# Altium project Node.PrjPCB
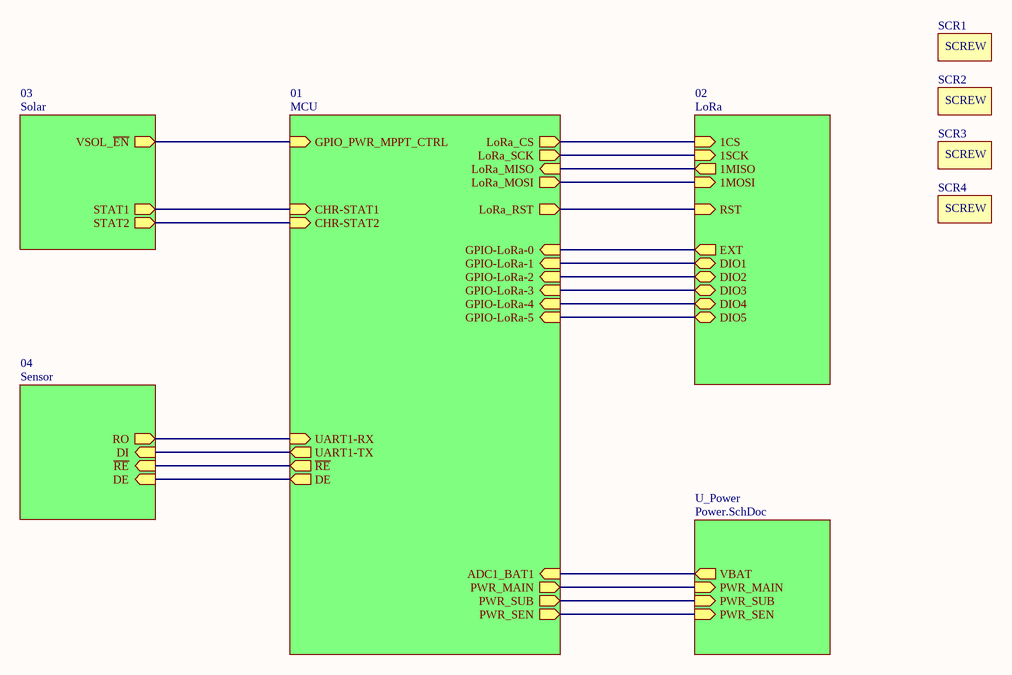
[diagram p0: Main.SchDoc]
6 sheets, 140 parts. Net scope: hierarchical (ports join the sheet entries above them; power ports are global).
Board file: Node_v2.PcbDoc
Sheets:
  Main.SchDoc
    03 = Solar.SchDoc
    01 = MCU.SchDoc
    02 = LoRa.SchDoc
    04 = Sensor.SchDoc
    U_Power = Power.SchDoc

## Sheet Main.SchDoc: =ProjectName
size A4; CheckedBy: DatNB; Author: Ven; CompanyName: Nacentech; Organization: IMET

### Parts
SCR1  Screw 3mm  [SCREW]  (value not drawn)
SCR2  Screw 3mm  [SCREW]  (value not drawn)
SCR3  Screw 3mm  [SCREW]  (value not drawn)
SCR4  Screw 3mm  [SCREW]  (value not drawn)

### Sub-sheets
01 = MCU: LoRa_MOSI (out), LoRa_MISO (in), CHR-STAT2 (in), CHR-STAT1 (in), UART1-TX (out), ADC1_BAT1 (in), LoRa_RST (out), LoRa_CS (out), UART1-RX (in), LoRa_SCK (out), GPIO_PWR_MPPT_CTRL (in), GPIO-LoRa-4 (in), GPIO-LoRa-1 (in), GPIO-LoRa-0 (in), GPIO-LoRa-3 (in), GPIO-LoRa-5 (in), GPIO-LoRa-2 (in), PWR_SEN (out), PWR_MAIN (out), PWR_SUB (out), DE (out), ~{RE} (out)
02 = LoRa: 1CS (in), 1MOSI (in), EXT (out), 1MISO (out), 1SCK (in), RST (in), DIO4 (bidir), DIO5 (bidir), DIO1 (bidir), DIO3 (bidir), DIO2 (bidir)
03 = Solar: STAT1 (out), STAT2 (out), VSOL_~{EN} (out)
04 = Sensor: RO (out), DI (in), ~{RE} (in), DE (in)
U_Power = Power.SchDoc: VBAT (out), PWR_SUB (in), PWR_MAIN (in), PWR_SEN (in)

### Nets
NetR14_2: sheet 01/UART1-RX, sheet 04/RO
NetR15_2: sheet 01/~{RE}, sheet 04/~{RE}
NetR17_2: sheet 01/DE, sheet 04/DE
NetR18_2: sheet 01/UART1-TX, sheet 04/DI
NetR24_1: sheet 01/ADC1_BAT1, sheet U_Power/VBAT
NetR34_2: sheet 01/PWR_SEN, sheet U_Power/PWR_SEN
NetR35_2: sheet 01/PWR_SUB, sheet U_Power/PWR_SUB
NetR36_2: sheet 01/PWR_MAIN, sheet U_Power/PWR_MAIN
NetR48_1: sheet 03/STAT1, sheet 01/CHR-STAT1
NetR49_1: sheet 03/STAT2, sheet 01/CHR-STAT2
NetR52_2: sheet 03/VSOL_~{EN}, sheet 01/GPIO_PWR_MPPT_CTRL
NetU1_4: sheet 01/LoRa_RST, sheet 02/RST
NetU1_5: sheet 01/GPIO-LoRa-0, sheet 02/EXT
NetU1_6: sheet 01/GPIO-LoRa-1, sheet 02/DIO1
NetU1_7: sheet 01/GPIO-LoRa-2, sheet 02/DIO2
NetU1_8: sheet 01/GPIO-LoRa-3, sheet 02/DIO3
NetU1_10: sheet 01/GPIO-LoRa-4, sheet 02/DIO4
NetU1_11: sheet 01/GPIO-LoRa-5, sheet 02/DIO5
NetU1_12: sheet 01/LoRa_SCK, sheet 02/1SCK
NetU1_13: sheet 01/LoRa_MISO, sheet 02/1MISO
NetU1_14: sheet 01/LoRa_MOSI, sheet 02/1MOSI
NetU1_15: sheet 01/LoRa_CS, sheet 02/1CS

Not connected (* = marked no-connect by the designer): SCR1 0; SCR2 0; SCR3 0; SCR4 0

### Notes on the sheet
- Project:
- Page Contents:
- Size:
- Date:
- A4
- Checked by:
- Time:
- Revision:
- Sheet
- of
- File:
- (in symbol screw3m) SCREW

### Library data of the parts
SCR1-SCR4 = screw3m

## Sheet Solar.SchDoc: =ProjectName
size A4; CheckedBy: DatNB; Author: Ven; CompanyName: Nacentech; Organization: IMET
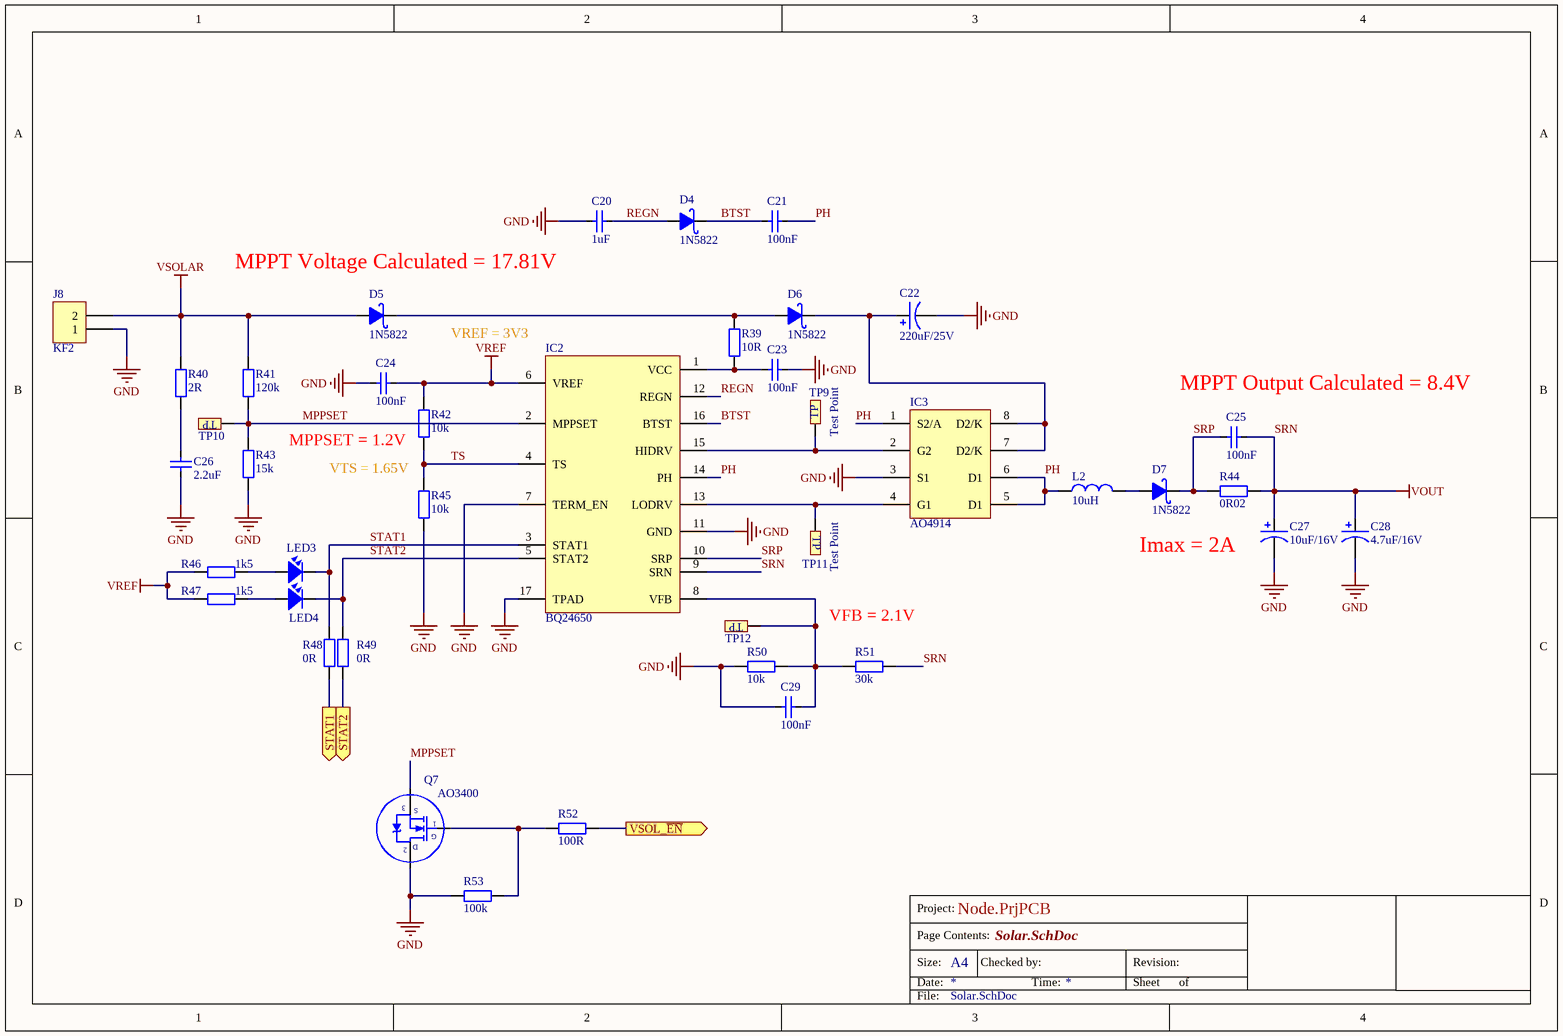
[diagram p1: Solar.SchDoc]

### Parts
C20  1uF  [CAP_0805]
C21  100nF  [CAP_0805]
C22  220uF/25V  [C5mm]
C23  100nF  [CAP_0805]
C24  100nF  [CAP_0805]
C25  100nF  [CAP_0805]
C26  2.2uF  [CAP_0805]
C27  10uF/16V  [C5mm]
C28  4.7uF/16V  [C5mm]
C29  100nF  [CAP_0805]
D4  1N5822  [DIO-214AC(SMA)]
D5  1N5822  [DIO-214AC(SMA)]
D6  1N5822  [DIO-214AC(SMA)]
D7  1N5822  [DIO-214AC(SMA)]
IC2  BQ24650  [VQFN-16]
IC3  AO4914  [SOIC-8]
J8  KF2  [KF2-5.08]
L2  10uH  [L-SMD-M-7.3x4.5]
LED3  LED  [LED-0805-Red]  (value not drawn)
LED4  LED  [LED-0805-Orange]  (value not drawn)
Q7  AO3400  [SOT23A]
R39  10R  [RES-SMD-0805]
R40  2R  [RES-SMD-0805]
R41  120k  [RES-SMD-0805]
R42  10k  [RES-SMD-0805]
R43  15k  [RES-SMD-0805]
R44  0R02  [RES-SMD-2512]
R45  10k  [RES-SMD-0805]
R46  1k5  [RES-SMD-0805]
R47  1k5  [RES-SMD-0805]
R48  0R  [RES-SMD-0805]
R49  0R  [RES-SMD-0805]
R50  10k  [RES-SMD-0805]
R51  30k  [RES-SMD-0805]
R52  100R  [RES-SMD-0805]
R53  100k  [RES-SMD-0805]
TP9  Test Point  [TP_SMD]
TP10  Test Point  [TP_SMD]  (value not drawn)
TP11  Test Point  [TP_SMD]
TP12  Test Point  [TP_SMD]  (value not drawn)

### Ports
STAT1 (out), STAT2 (out), VSOL_~{EN} (out)

### Nets
GND: C20.2 C22.2 C23.2 C24.2 C26.1 C27.2 C28.2 C29.1 IC2.7(TERM_EN) IC2.11(GND) IC2.17(TPAD) IC3.3(S1) J8.1 Q7.2(D) R43.2 R45.1 R50.1 R53.2
SRN: C25.1 C27.1 C28.1 IC2.9(SRN) R44.2 R51.1  [also labelled VOUT]
VREF: C24.1 IC2.6(VREF) R42.1 R46.1 R47.1
VSOLAR: D5.1(A) J8.2 R40.1 R41.2
BTST: C21.1 D4.2(K) IC2.16(BTST)
MPPSET: IC2.2(MPPSET) Q7.3(S) R41.1 R43.1 TP10.1
PH: C21.2 IC2.14(PH) IC3.1(S2/A) IC3.5(D1) IC3.6(D1) L2.1
REGN: C20.1 D4.1(A) IC2.12(REGN)
SRP: C25.2 D7.2(K) IC2.10(SRP) R44.1
STAT1: IC2.3(STAT1) LED3.2 R48.2
STAT2: IC2.5(STAT2) LED4.2 R49.2
TS: IC2.4(TS) R42.2 R45.2
NetC22_1: C22.1 D6.2(K) IC3.7(D2/K) IC3.8(D2/K)
NetC23_1: C23.1 IC2.1(VCC) R39.2
NetC26_2: C26.2 R40.2
NetC29_2: C29.2 IC2.8(VFB) R50.2 R51.2 TP12.1
NetD5_2: D5.2(K) D6.1(A) R39.1
NetD7_1: D7.1(A) L2.2
NetIC2_13: IC2.13(LODRV) IC3.4(G1) TP11.1
NetIC2_15: IC2.15(HIDRV) IC3.2(G2) TP9.1
NetLED3_1: LED3.1 R46.2
NetLED4_1: LED4.1 R47.2
NetQ7_1: Q7.1(G) R52.1 R53.1
NetR48_1: R48.1 ; port STAT1
NetR49_1: R49.1 ; port STAT2
NetR52_2: R52.2 ; port VSOL_~{EN}

### Notes on the sheet
- MPPT Voltage Calculated = 17.81V
- (near IC2) VREF = 3V3
- MPPSET = 1.2V
- (near C25) MPPT Output Calculated = 8.4V
- VTS = 1.65V
- Imax = 2A
- (near R51) VFB = 2.1V
- Project:
- Page Contents:
- Size:
- Date:
- A4
- Checked by:
- Time:
- Revision:
- Sheet
- of
- File:

### Library data of the parts
C20 C21 C23-C26 C29 = CapSMD: Capacitor; Value: 33p; Published: 8-Jun-2000; LatestRevisionDate: 17-Jul-2002; LatestRevisionNote: Re-released for DXP Platform.; PackageReference: RAD-0.3; Publisher: Altium Limited
C22 C27 C28 = Cap Pol: Polarized Capacitor (Axial); Published: 8-Jun-2000; LatestRevisionDate: 17-Jul-2002; LatestRevisionNote: Re-released for DXP Platform.; PackageReference: POLAR0.8; Publisher: Altium Limited
D4-D7 = 1N5822: Schottky Rectifiers; Value: Diode c?m 1N5408
IC2 = BQ24650: BQ24650 Stand-Alone Synchronous Buck Battery Charge Controller for Solar Power / With Maximum Power Point Tracking
IC3 = AO4914: Dual N-Channel Enhancement Mode Field Effect Transistor with Schottky Diode
J8 = KF2: Manufacturer: Würth Elektronik eiSos GmbH; partNo: 691103110002; ComponentLink1 Description: Manufacturer; ComponentLink2 Description: Datasheet; NoPins: 2; Created Date: 29 October 2013; ComponentLink1URL: http://www.we-online.com; ComponentLink2URL: http://katalog.we-online.de/em/datasheet/6911031100xx.pdf; Created by: Karrer Zheng
L2 = Inductor: Value: 150 mH
LED3 LED4 = LED: LED Single colour Green and Red; Value: LED 3 ly Single Colour
Q7 = MOSFET_N: Generic N Channel MOSFET
R39-R53 = Resistor - SMD: Resistor SMD; Manufacturer: Generic Components; Class: Passive; Published: 08/06/2000; Publisher: Altium Hobart Technology Centre
TP9-TP12 = TP: CONNECT 1

## Sheet MCU.SchDoc: =ProjectName
size A4; CheckedBy: DatNB; Author: Ven; CompanyName: Nacentech; Organization: IMET
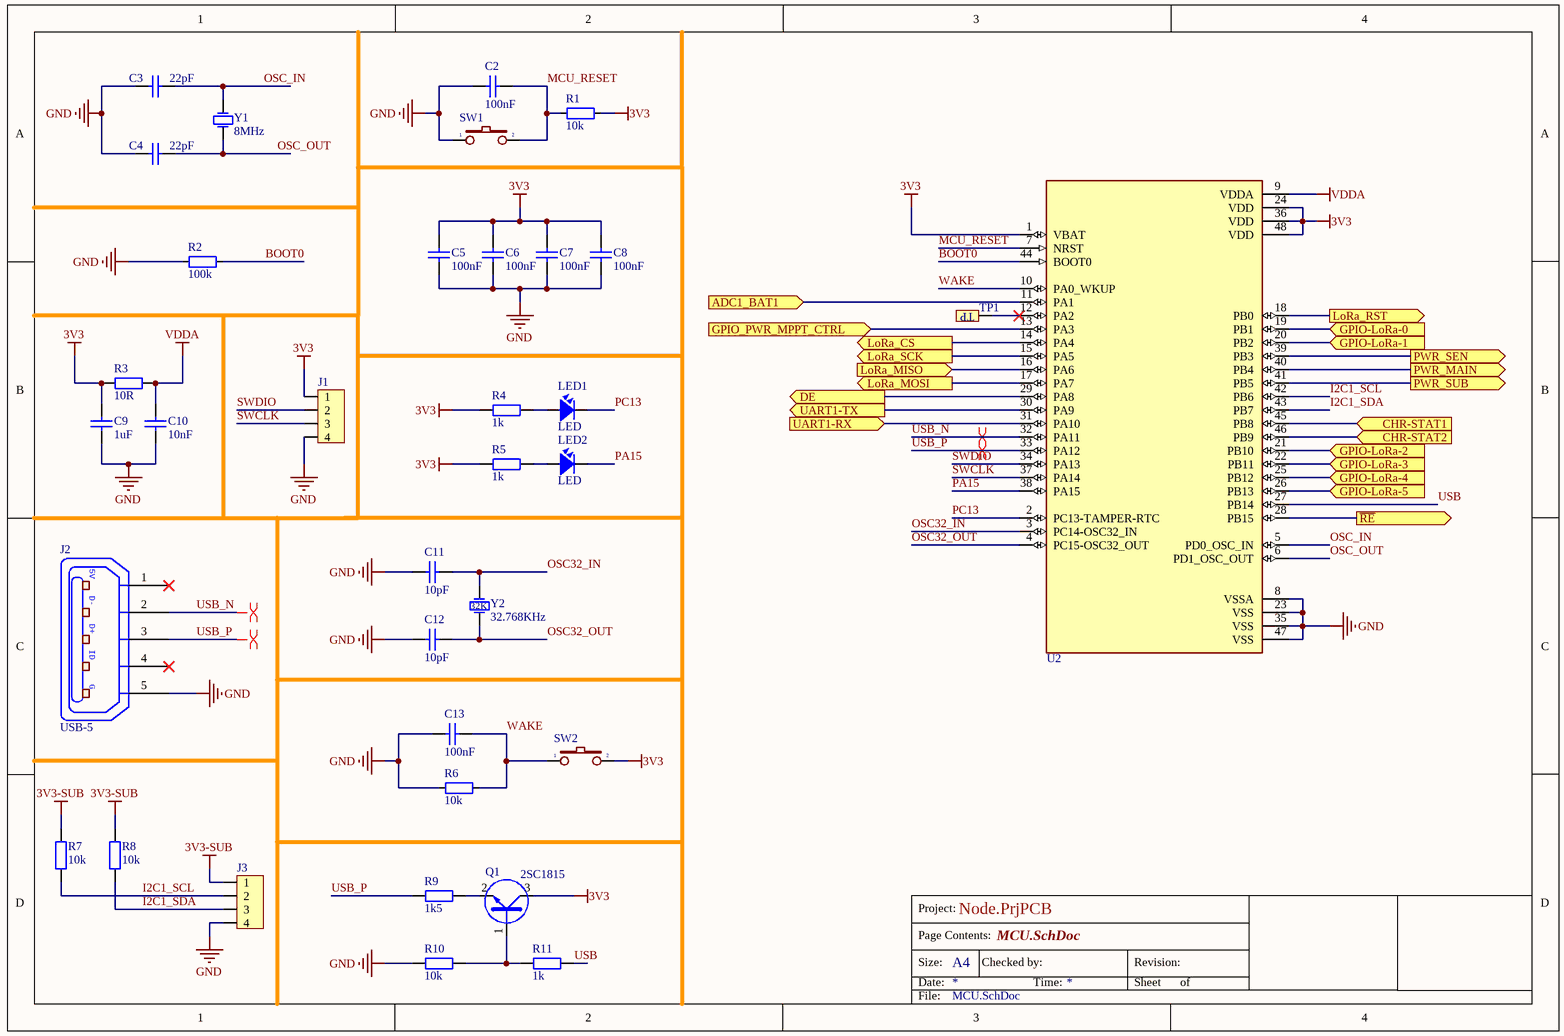
[diagram p2: MCU.SchDoc]

### Parts
C2  100nF  [CAP_0805]
C3  22pF  [CAP_0805]
C4  22pF  [CAP_0805]
C5  100nF  [CAP_0805]
C6  100nF  [CAP_0805]
C7  100nF  [CAP_0805]
C8  100nF  [CAP_0805]
C9  1uF  [CAP_0805]
C10  10nF  [CAP_0805]
C11  10pF  [CAP_0805]
C12  10pF  [CAP_0805]
C13  100nF  [CAP_0805]
J1  ST_Link  [HEADER4P-1.25]  (value not drawn)
J2  USB-5  [USB-M4]
J3  ST_Link  [HEADER4P-1.25]  (value not drawn)
LED1  LED  [LED-0805-Red]
LED2  LED  [LED-0805-Yellow]
Q1  2SC1815  [SOT23D]
R1  10k  [RES-SMD-0805]
R2  100k  [RES-SMD-0805]
R3  10R  [RES-SMD-0805]
R4  1k  [RES-SMD-0805]
R5  1k  [RES-SMD-0805]
R6  10k  [RES-SMD-0805]
R7  10k  [RES-SMD-0805]
R8  10k  [RES-SMD-0805]
R9  1k5  [RES-SMD-0805]
R10  10k  [RES-SMD-0805]
R11  1k  [RES-SMD-0805]
SW1  SW  [SW 3x2x4]  (value not drawn)
SW2  SW  [SW 3x2x4]  (value not drawn)
TP1  Test Point  [TP_SMD]  (value not drawn)
U2  STM32  [LQFP 48]  (value not drawn)
Y1  8MHz  [XTAL]
Y2  32.768KHz  [XTAL32K]

### Ports
ADC1_BAT1 (in), CHR-STAT1 (in), CHR-STAT2 (in), DE (out), GPIO-LoRa-0 (in), GPIO-LoRa-1 (in), GPIO-LoRa-2 (in), GPIO-LoRa-3 (in), GPIO-LoRa-4 (in), GPIO-LoRa-5 (in), GPIO_PWR_MPPT_CTRL (in), LoRa_CS (out), LoRa_MISO (in), LoRa_MOSI (out), LoRa_RST (out), LoRa_SCK (out), PWR_MAIN (out), PWR_SEN (out), PWR_SUB (out), UART1-RX (in), UART1-TX (out), ~{RE} (out)

### Nets
3V3: C5.2 C6.2 C7.2 C8.2 C9.2 J1.1 Q1.3(C) R1.1 R3.1 R4.1 R5.1 SW2.2 U2.1(VBAT) U2.24(VDD) U2.36(VDD) U2.48(VDD)
3V3-SUB: J3.1 R7.2 R8.2
GND: C2.1 C3.1 C4.1 C5.1 C6.1 C7.1 C8.1 C9.1 C10.1 C11.2 C12.2 C13.1 J1.4 J2.5(P5) J3.4 R2.2 R6.2 R10.1 SW1.1 U2.8(VSSA) U2.23(VSS) U2.35(VSS) U2.47(VSS)
VDDA: C10.2 R3.2 U2.9(VDDA)
BOOT0: R2.1 U2.44(BOOT0)
I2C1_SCL: J3.2 R7.1 U2.42(PB6)
I2C1_SDA: J3.3 R8.1 U2.43(PB7)
MCU_RESET: C2.2 R1.2 SW1.2 U2.7(NRST)
OSC32_IN: C11.1 U2.3(PC14-OSC32_IN) Y2.1(OSC1)
OSC32_OUT: C12.1 U2.4(PC15-OSC32_OUT) Y2.2(OSC2)
OSC_IN: C3.2 U2.5(PD0_OSC_IN) Y1.1(OSC1)
OSC_OUT: C4.2 U2.6(PD1_OSC_OUT) Y1.2(OSC2)
PA15: LED2.2 U2.38(PA15)
PC13: LED1.2 U2.2(PC13-TAMPER-RTC)
SWCLK: J1.3 U2.37(PA14)
SWDIO: J1.2 U2.34(PA13)
USB: R11.2 U2.27(PB14)
USB_N: J2.2(P2) U2.32(PA11)
USB_P: J2.3(P3) R9.1 U2.33(PA12)
WAKE: C13.2 R6.1 SW2.1 U2.10(PA0_WKUP)
NetLED1_1: LED1.1 R4.2
NetLED2_1: LED2.1 R5.2
NetQ1_1: Q1.1(B) R10.2 R11.1
NetQ1_2: Q1.2(E) R9.2
NetR14_2: U2.31(PA10) ; port UART1-RX
NetR15_2: U2.28(PB15) ; port ~{RE}
NetR17_2: U2.29(PA8) ; port DE
NetR18_2: U2.30(PA9) ; port UART1-TX
NetR24_1: U2.11(PA1) ; port ADC1_BAT1
NetR34_2: U2.39(PB3) ; port PWR_SEN
NetR35_2: U2.41(PB5) ; port PWR_SUB
NetR36_2: U2.40(PB4) ; port PWR_MAIN
NetR48_1: U2.45(PB8) ; port CHR-STAT1
NetR49_1: U2.46(PB9) ; port CHR-STAT2
NetR52_2: U2.13(PA3) ; port GPIO_PWR_MPPT_CTRL
NetTP1_1: TP1.1 U2.12(PA2)
NetU1_4: U2.18(PB0) ; port LoRa_RST
NetU1_5: U2.19(PB1) ; port GPIO-LoRa-0
NetU1_6: U2.20(PB2) ; port GPIO-LoRa-1
NetU1_7: U2.21(PB10) ; port GPIO-LoRa-2
NetU1_8: U2.22(PB11) ; port GPIO-LoRa-3
NetU1_10: U2.25(PB12) ; port GPIO-LoRa-4
NetU1_11: U2.26(PB13) ; port GPIO-LoRa-5
NetU1_12: U2.15(PA5) ; port LoRa_SCK
NetU1_13: U2.16(PA6) ; port LoRa_MISO
NetU1_14: U2.17(PA7) ; port LoRa_MOSI
NetU1_15: U2.14(PA4) ; port LoRa_CS

Not connected (* = marked no-connect by the designer): J2 1(P1)* 4(P4)*

### Layout directives
differential pair: USB_N, USB_P

### Notes on the sheet
- Project:
- Page Contents:
- Size:
- Date:
- A4
- Checked by:
- Time:
- Revision:
- Sheet
- of
- File:
- (in symbol USB-5) 5V; D-; D+; ID; G
- (in symbol XTAL/32KHz) 32K

### Library data of the parts
C2-C13 = CapSMD: Capacitor; Value: 33p; Published: 8-Jun-2000; LatestRevisionDate: 17-Jul-2002; LatestRevisionNote: Re-released for DXP Platform.; PackageReference: RAD-0.3; Publisher: Altium Limited
J1 J3 = Header4: Header IDC, 4 x 1 Pin Vertical 2.54mm Pitch (Non-Boxed, Male); Manufacturer: W¨¹rth Elektronik eiSos GmbH; partNo: 613002143121; ComponentLink1 Description: Manufacturer; ComponentLink2 Description: Datasheet; NoPins: 02; Created Date: 29 March 2013; ComponentLink1URL: http://www.we-online.com; ComponentLink2URL: http://katalog.we-online.de/em/datasheet/6130xx143121.pdf; Created by: Karrer Zheng
J2 = USB-5: Manufacturer: FCI; Manufacturer Part Number: 10118193-0001LF; Connector Type: USB - micro B; Number of Contacts: 5; Gender: Receptacle; Specifications: USB 2.0; .Creator: MM; .Checked PCB: RF; Supplier 1: Digi-Key; RoHS: RoHS Compliant; Category: Connectors, Interconnects; Stock 1: 28642; Pricing 1: 1=0.46, 10=0.433, 25=0.3712, 50=0.3156, 100=0.3032, 250=0.27224, 500=0.25988 (USD); Packaging: Cut Tape (CT); Mounting Type: Surface Mount, Right Angle, Horizontal; Features: Shielded, Solder Retention; Ingress Protection: -; ComponentLink1URL: http://portal.fciconnect.com/Comergent//fci/drawing/10118193.pdf; ComponentLink1Description: http://portal.fciconnect.com/Comergent//fci/drawing/10118193.pdf; Supplier Part Number 1: 609-4616-1-ND; .Checked SCH: MM
LED1 LED2 = LED: as LED3 on sheet Solar
Q1 = C1815: NPN 600mW, ECB; Value: C1815
R1 R2 R6 = Resistor - SMD: Resistor; Manufacturer: Generic Components; Class: Passive; Published: 08/06/2000; Publisher: Altium Hobart Technology Centre
R3-R5 R7-R11 = Resistor - SMD: as R39 on sheet Solar; Published: 08/06/2000; Publisher: Altium Hobart Technology Centre
SW1 SW2 = SW2: Switch button 2 pin; Value: SW chip 2 pin
TP1 = TP: CONNECT 1
U2 = STM32F103C8T6: STM32 ARM-based 32-bit MCU with 64 Kbytes Flash, 64-pin LQFP, Industrial Temperature
Y1 = XTAL: Crystal Oscillator; Published: 8-Jun-2000; LatestRevisionDate: 17-Jul-2002; LatestRevisionNote: Re-released for DXP Platform.; PackageReference: R38; Publisher: Altium Limited
Y2 = XTAL/32KHz: Crystal Oscillator; Published: 8-Jun-2000; LatestRevisionDate: 17-Jul-2002; LatestRevisionNote: Re-released for DXP Platform.; PackageReference: R38; Publisher: Altium Limited

## Sheet LoRa.SchDoc: =ProjectName
size A4; CheckedBy: DatNB; Author: Ven; CompanyName: Nacentech; Organization: IMET
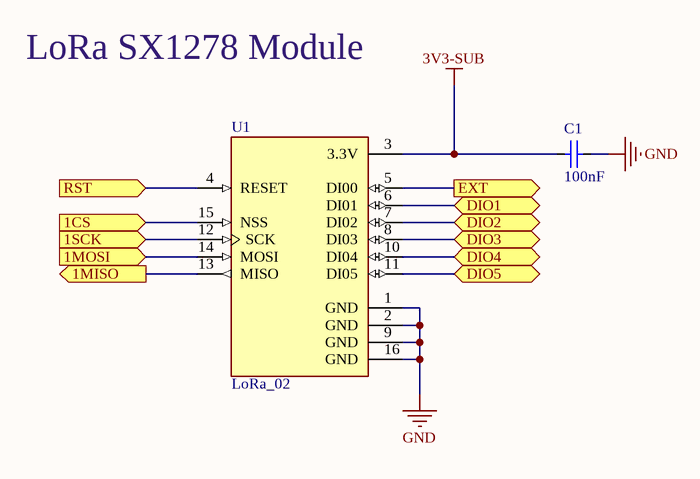
[diagram p3: LoRa.SchDoc]

### Parts
C1  100nF  [CAP_0805]
U1  LoRa_02  [Ra-02]

### Ports
1CS (in), 1MISO (out), 1MOSI (in), 1SCK (in), DIO1 (bidir), DIO2 (bidir), DIO3 (bidir), DIO4 (bidir), DIO5 (bidir), EXT (out), RST (in)

### Nets
3V3-SUB: C1.1 U1.3(3.3V)
GND: C1.2 U1.1(GND) U1.2(GND) U1.9(GND) U1.16(GND)
NetU1_4: U1.4(RESET) ; port RST
NetU1_5: U1.5(DI00) ; port EXT
NetU1_6: U1.6(DI01) ; port DIO1
NetU1_7: U1.7(DI02) ; port DIO2
NetU1_8: U1.8(DI03) ; port DIO3
NetU1_10: U1.10(DI04) ; port DIO4
NetU1_11: U1.11(DI05) ; port DIO5
NetU1_12: U1.12(SCK) ; port 1SCK
NetU1_13: U1.13(MISO) ; port 1MISO
NetU1_14: U1.14(MOSI) ; port 1MOSI
NetU1_15: U1.15(NSS) ; port 1CS

### Notes on the sheet
- LoRa SX1278 Module
- Project:
- Page Contents:
- Size:
- Date:
- A4
- Checked by:
- Time:
- Revision:
- Sheet
- of
- File:

### Library data of the parts
C1 = CapSMD: Capacitor; Value: 33p; Published: 8-Jun-2000; LatestRevisionDate: 17-Jul-2002; LatestRevisionNote: Re-released for DXP Platform.; PackageReference: RAD-0.3; Publisher: Altium Limited

## Sheet Sensor.SchDoc: =ProjectName
size A4; CheckedBy: DatNB; Author: Ven; CompanyName: Nacentech; Organization: IMET
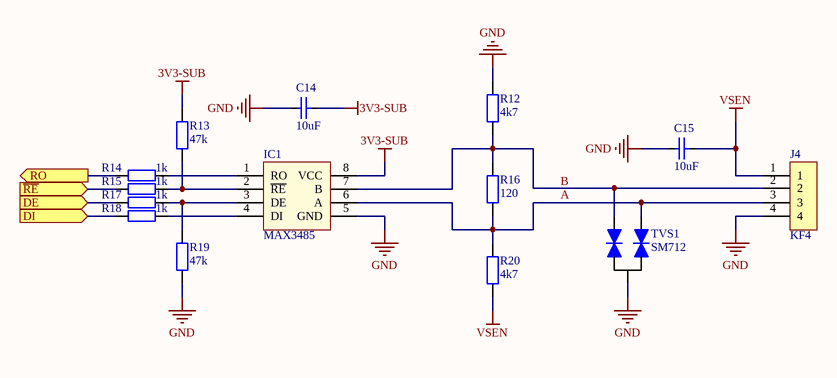
[diagram p4: Sensor.SchDoc]

### Parts
C14  10uF  [CAP_0805]
C15  10uF  [CAP_0805]
IC1  MAX3485  [SO-8]
J4  KF4  [KF4-5.08]
R12  4k7  [RES-SMD-0805]
R13  47k  [RES-SMD-0805]
R14  1k  [RES-SMD-0805]
R15  1k  [RES-SMD-0805]
R16  120  [RES-SMD-0805]
R17  1k  [RES-SMD-0805]
R18  1k  [RES-SMD-0805]
R19  47k  [RES-SMD-0805]
R20  4k7  [RES-SMD-0805]
TVS1  SM712  [SOT23]

### Ports
DE (in), DI (in), RO (out), ~{RE} (in)

### Nets
3V3-SUB: C14.2 IC1.8(VCC) R13.1
GND: C14.1 C15.1 IC1.5(GND) J4.4 R12.2 R19.2 TVS1.3(K)
VSEN: C15.2 J4.1 R20.1
A: IC1.6(A) J4.3 R16.1 R20.2 TVS1.1(A)
NetIC1_1: IC1.1(RO) R14.1
NetIC1_2: IC1.2(~{RE}) R13.2 R15.1
NetIC1_3: IC1.3(DE) R17.1 R19.1
NetIC1_4: IC1.4(DI) R18.1
NetIC1_7: IC1.7(B) J4.2 R12.1 R16.2 TVS1.2(A)
NetR14_2: R14.2 ; port RO
NetR15_2: R15.2 ; port ~{RE}
NetR17_2: R17.2 ; port DE
NetR18_2: R18.2 ; port DI

### Notes on the sheet
- Labels drawn without touching a wire or pin: B
- Project:
- Page Contents:
- Size:
- Date:
- A4
- Checked by:
- Time:
- Revision:
- Sheet
- of
- File:

### Library data of the parts
C14 C15 = CapSMD: Capacitor; Value: 33p; Published: 8-Jun-2000; LatestRevisionDate: 17-Jul-2002; LatestRevisionNote: Re-released for DXP Platform.; PackageReference: RAD-0.3; Publisher: Altium Limited
IC1 = MAX485: RS232 - RS485 (Same sn75176)
J4 = KF4: Manufacturer: W¨¹rth Elektronik eiSos GmbH; PartNo: 691133710004; ComponentLink1 Description: Manufacturer; ComponentLink2 Description: Datasheet; NoPins: 4; ComponentLink1 URL: http://www.we-online.com; ComponentLink2 URL: http://katalog.we-online.de/em/datasheet/6911337100xx.pdf; Created By: Baojun Chen; Created Date: 4-Aug-15
R12-R20 = Resistor - SMD: as R39 on sheet Solar; Published: 08/06/2000; Publisher: Altium Hobart Technology Centre
TVS1 = BAV70: Value: 1N4148

## Sheet Power.SchDoc: =ProjectName
size A4; CheckedBy: DatNB; Author: Ven; CompanyName: Nacentech; Organization: IMET
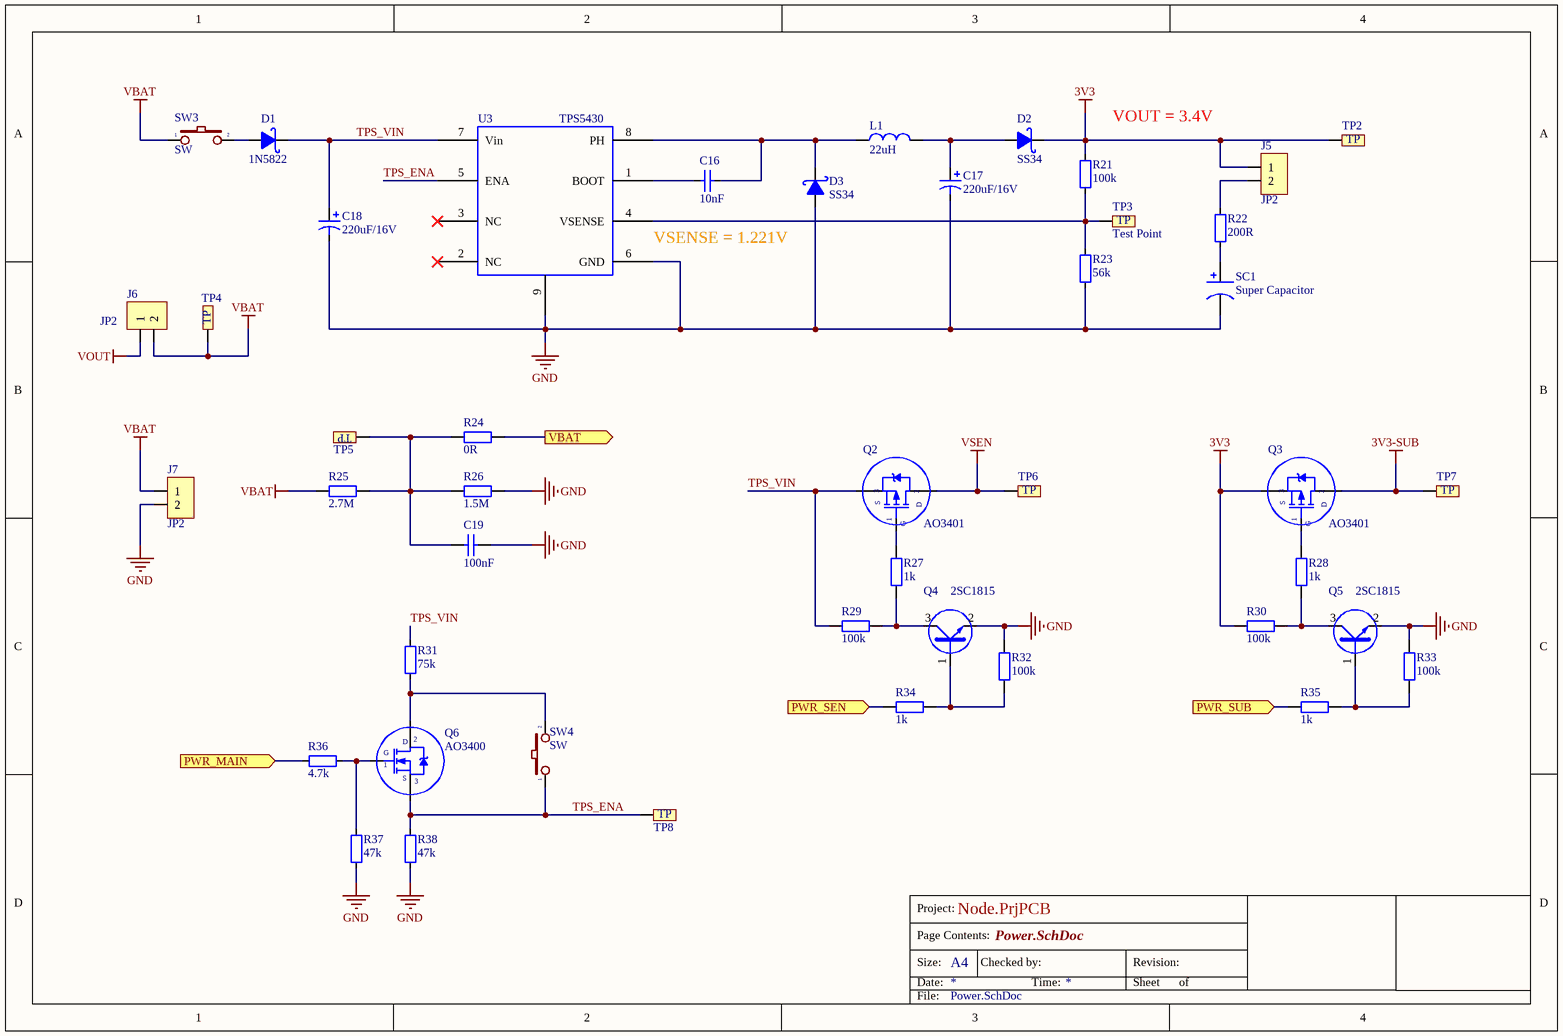
[diagram p5: Power.SchDoc]

### Parts
C16  10nF  [CAP_0805]
C17  220uF/16V  [C8mm]
C18  220uF/16V  [C8mm]
C19  100nF  [CAP_0805]
D1  1N5822  [DIO-214AC(SMA)]
D2  SS34  [DO-214AC(SMA)]
D3  SS34  [DO-214AC(SMA)]
J5  JP2  [JP2-CLOSED]
J6  JP2  [JP2-CLOSED]
J7  JP2  [CON2]
L1  22uH  [L-SMD-M-7.3x4.5]
Q2  AO3401  [SOT23A]
Q3  AO3401  [SOT23A]
Q4  2SC1815  [SOT23D]
Q5  2SC1815  [SOT23D]
Q6  AO3400  [SOT23A]
R21  100k  [RES-SMD-0805]
R22  200R  [RES-SMD-0805]
R23  56k  [RES-SMD-0805]
R24  0R  [RES-SMD-0805]
R25  2.7M  [RES-SMD-0805]
R26  1.5M  [RES-SMD-0805]
R27  1k  [RES-SMD-0805]
R28  1k  [RES-SMD-0805]
R29  100k  [RES-SMD-0805]
R30  100k  [RES-SMD-0805]
R31  75k  [RES-SMD-0805]
R32  100k  [RES-SMD-0805]
R33  100k  [RES-SMD-0805]
R34  1k  [RES-SMD-0805]
R35  1k  [RES-SMD-0805]
R36  4.7k  [RES-SMD-0805]
R37  47k  [RES-SMD-0805]
R38  47k  [RES-SMD-0805]
SC1  Super Capacitor  [SUPERCAPHC]
SW3  SW  [SW102_SIDE]
SW4  SW  [SW 3x2x4]
TP2  Test Point  [TP_SMD]  (value not drawn)
TP3  Test Point  [TP_SMD]
TP4  Test Point  [TP_SMD]  (value not drawn)
TP5  Test Point  [TP_SMD]  (value not drawn)
TP6  Test Point  [TP_SMD]  (value not drawn)
TP7  Test Point  [TP_SMD]  (value not drawn)
TP8  Test Point  [TP_SMD]  (value not drawn)
U3  TPS5430  [TPS5430-2]

### Ports
PWR_MAIN (in), PWR_SEN (in), PWR_SUB (in), VBAT (out)

### Nets
3V3: D2.2(K) J5.1 Q3.3(S) R21.2 R30.1 TP2.1
3V3-SUB: Q3.2(D) TP7.1
GND: C17.2 C18.2 C19.1 D3.1(A) J7.2 Q4.2(E) Q5.2(E) R23.1 R26.1 R32.2 R33.2 R37.1 R38.1 SC1.2 U3.6(GND) U3.9(PWR_PAD)
VBAT: J6.2 J7.1 R25.2 SW3.1 TP4.1
VOUT: J6.1  [project net SRN]
VSEN: Q2.2(D) TP6.1
TPS_ENA: Q6.3(S) R38.2 SW4.1 TP8.1 U3.5(ENA)
TPS_VIN: C18.1 D1.2(K) Q2.3(S) R29.1 R31.2 U3.7(Vin)
NetC16_1: C16.1 D3.2(K) L1.1 U3.8(PH)
NetC16_2: C16.2 U3.1(BOOT)
NetC17_1: C17.1 D2.1(A) L1.2
NetC19_2: C19.2 R24.2 R25.1 R26.2 TP5.1
NetD1_1: D1.1(A) SW3.2
NetJ5_2: J5.2 R22.2
NetQ2_1: Q2.1(G) R27.2
NetQ3_1: Q3.1(G) R28.2
NetQ4_1: Q4.1(B) R32.1 R34.1
NetQ4_3: Q4.3(C) R27.1 R29.2
NetQ5_1: Q5.1(B) R33.1 R35.1
NetQ5_3: Q5.3(C) R28.1 R30.2
NetQ6_1: Q6.1(G) R36.1 R37.2
NetQ6_2: Q6.2(D) R31.1 SW4.2
NetR21_1: R21.1 R23.2 TP3.1 U3.4(VSENSE)
NetR22_1: R22.1 SC1.1
NetR24_1: R24.1 ; port VBAT
NetR34_2: R34.2 ; port PWR_SEN
NetR35_2: R35.2 ; port PWR_SUB
NetR36_2: R36.2 ; port PWR_MAIN

Not connected (* = marked no-connect by the designer): U3 2(NC)* 3(NC)*

### Notes on the sheet
- VOUT = 3.4V
- VSENSE = 1.221V
- Project:
- Page Contents:
- Size:
- Date:
- A4
- Checked by:
- Time:
- Revision:
- Sheet
- of
- File:

### Library data of the parts
C16 C19 = CapSMD: Capacitor; Value: 33p; Published: 8-Jun-2000; LatestRevisionDate: 17-Jul-2002; LatestRevisionNote: Re-released for DXP Platform.; PackageReference: RAD-0.3; Publisher: Altium Limited
C17 C18 = Cap Pol: Polarized Capacitor (Axial); Published: 8-Jun-2000; LatestRevisionDate: 17-Jul-2002; LatestRevisionNote: Re-released for DXP Platform.; PackageReference: POLAR0.8; Publisher: Altium Limited
D1 = 1N5822: as D4 on sheet Solar
D2 D3 = Diode Schottky: Diode Schottky SS34
J5-J7 = JP2: WR-PHD 2.54 mm Angled Socket Header; Manufacturer: W¨¹rth Elektronik eiSos GmbH; partNo: 613002143121; ComponentLink1 Description: Manufacturer; ComponentLink2 Description: Datasheet; NoPins: 02; Created Date: 29 March 2013; ComponentLink1URL: http://www.we-online.com; ComponentLink2URL: http://katalog.we-online.de/em/datasheet/6130xx143121.pdf; Created by: Karrer Zheng
L1 = Inductor: Value: 150 mH
Q2 Q3 = MOSFET_P: 30V 5.8A P-Channel MOSFET
Q4 Q5 = C1815: NPN 600mW, ECB; Value: C1815
Q6 = MOSFET_N: Generic N Channel MOSFET
R21-R23 R31 R36-R38 = Resistor - SMD: as R1 on sheet MCU; Published: 08/06/2000; Publisher: Altium Hobart Technology Centre
R24-R30 R32-R35 = Resistor - SMD: as R39 on sheet Solar; Published: 08/06/2000; Publisher: Altium Hobart Technology Centre
SC1 = SuperCap
SW3 SW4 = SW2: as SW1 on sheet MCU
TP2-TP8 = TP: CONNECT 1
U3 = TPS5430: Name: TPS5430

## Nets that join several sheets
3V3: MCU (16 pins), Power (6 pins)
3V3-SUB: MCU (J3.1 R7.2 R8.2), LoRa (C1.1 U1.3), Sensor (C14.2 IC1.8 R13.1), Power (Q3.2 TP7.1)
GND: Solar (18 pins), MCU (23 pins), LoRa (5 pins), Sensor (7 pins), Power (16 pins)
SRN: Solar (6 pins), Power (J6.1)
VSEN: Sensor (C15.2 J4.1 R20.1), Power (Q2.2 TP6.1)
NetR14_2: MCU (U2.31), Sensor (R14.2)
NetR15_2: MCU (U2.28), Sensor (R15.2)
NetR17_2: MCU (U2.29), Sensor (R17.2)
NetR18_2: MCU (U2.30), Sensor (R18.2)
NetR24_1: MCU (U2.11), Power (R24.1)
NetR34_2: MCU (U2.39), Power (R34.2)
NetR35_2: MCU (U2.41), Power (R35.2)
NetR36_2: MCU (U2.40), Power (R36.2)
NetR48_1: Solar (R48.1), MCU (U2.45)
NetR49_1: Solar (R49.1), MCU (U2.46)
NetR52_2: Solar (R52.2), MCU (U2.13)
NetU1_4: MCU (U2.18), LoRa (U1.4)
NetU1_5: MCU (U2.19), LoRa (U1.5)
NetU1_6: MCU (U2.20), LoRa (U1.6)
NetU1_7: MCU (U2.21), LoRa (U1.7)
NetU1_8: MCU (U2.22), LoRa (U1.8)
NetU1_10: MCU (U2.25), LoRa (U1.10)
NetU1_11: MCU (U2.26), LoRa (U1.11)
NetU1_12: MCU (U2.15), LoRa (U1.12)
NetU1_13: MCU (U2.16), LoRa (U1.13)
NetU1_14: MCU (U2.17), LoRa (U1.14)
NetU1_15: MCU (U2.14), LoRa (U1.15)